# EAGLE design Test_board (EAGLE 9.6.2)
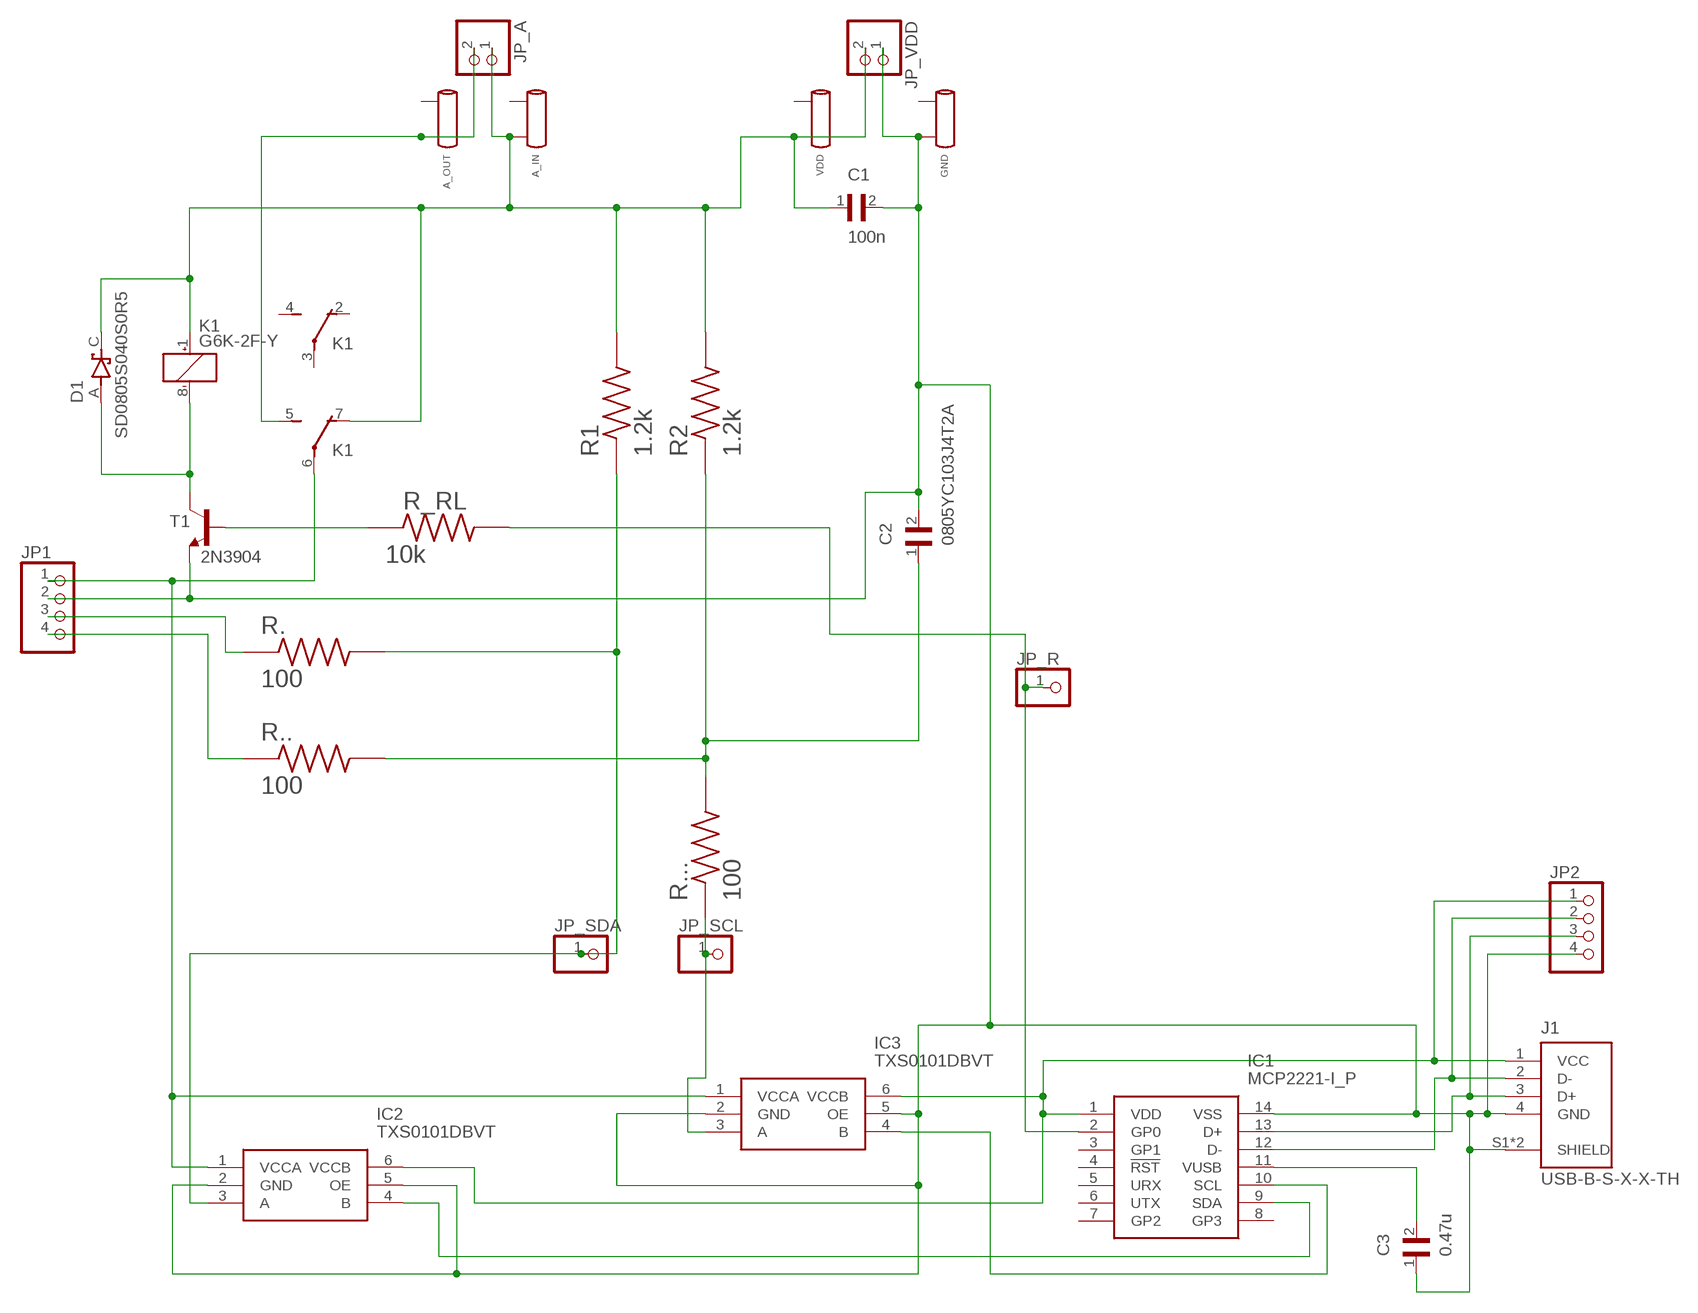
[diagram p0: schematic, sheet 1]

## Parts
A_IN  FY_TESTSOCKET  [FY_TESTSOCKET]
A_OUT  FY_TESTSOCKET  [FY_TESTSOCKET]
C1  100n  0805YC103J4T2A  [CAPC2012X94N]
C2  0805YC103J4T2A  [CAPC2012X94N]
C3  0.47u  0805YC103J4T2A  [CAPC2012X94N]
D1  SD0805S040S0R5  [DIOSC130X200X100-2N]
GND  FY_TESTSOCKET  [FY_TESTSOCKET]
IC1  MCP2221-I_P  [DIP781W56P254L1918H533Q14N]
IC2  TXS0101DBVT  [SOT95P280X145-6N]
IC3  TXS0101DBVT  [SOT95P280X145-6N]
J1  USB-B-S-X-X-TH  [SAMTEC_USB-B-S-X-X-TH]
JP1  PINHD-1X4  [1X04]
JP2  PINHD-1X4  [1X04]
JP_A  PINHD-1X2  [1X02]
JP_R  PINHD-1X1  [1X01]
JP_SCL  PINHD-1X1  [1X01]
JP_SDA  PINHD-1X1  [1X01]
JP_VDD  PINHD-1X2  [1X02]
K1  G6K-2F-Y  [G6K-2F-Y]
R1  1.2k  CR0805AJ/-000EAS  [RESC2012X60N]
R2  1.2k  CR0805AJ/-000EAS  [RESC2012X60N]
R.  100  CR0805AJ/-000EAS  [RESC2012X60N]
R..  100  CR0805AJ/-000EAS  [RESC2012X60N]
R...  100  CR0805AJ/-000EAS  [RESC2012X60N]
R_RL  10k  CR0805AJ/-000EAS  [RESC2012X60N]
T1  2N3904  [TO92]
VDD  FY_TESTSOCKET  [FY_TESTSOCKET]

## Nets
N$1: D1.A K1.8(1:-) T1.1(C)
N$2: C1.2 C2.2 C3.1 GND.P$2 IC1.14(VSS) IC2.2(GND) IC2.5(OE) IC3.2(GND) IC3.5(OE) J1.4(GND) J1.S1(SHIELD) J1.S2(SHIELD) JP1.2 JP2.4 JP_VDD.1 T1.3(E)
N$3: A_OUT.P$2 JP_A.2 K1.5(3:S)
N$4: C3.2 IC1.11(VUSB)
N$5: C2.1 R2.1 R...2 R....2
N$6: IC2.3(A) JP_SDA.1 R1.1 R..2
N$7: IC3.3(A) JP_SCL.1 R....1
N$8: JP1.3 R..1
N$9: JP1.4 R...1
N$10: IC2.1(VCCA) IC3.1(VCCA) JP1.1 K1.6(3:P)
N$11: IC1.9(SDA) IC2.4(B)
N$12: IC1.10(SCL) IC3.4(B)
N$13: IC1.1(VDD) IC2.6(VCCB) IC3.6(VCCB) J1.1(VCC) JP2.1
N$15: R_RL.1 T1.2(B)
N$16: A_IN.P$2 C1.1 D1.C(K) JP_A.1 JP_VDD.2 K1.1(1:+) K1.7(3:O) R1.2 R2.2 VDD.P$2
N$17: IC1.13(D+) J1.3(D+) JP2.3
N$18: IC1.12(D-) J1.2(D-) JP2.2
N$20: IC1.2(GP0) JP_R.1 R_RL.2
Unconnected: A_IN.P$1 A_OUT.P$1 GND.P$1 IC1.3(GP1) IC1.4(!RST) IC1.5(URX) IC1.6(UTX) IC1.7(GP2) IC1.8(GP3) K1.2(2:O) K1.3(2:P) K1.4(2:S) VDD.P$1

## Library data of the parts
A_IN A_OUT GND VDD = dut_kp300_manu_ch_multiple:FY_TESTSOCKET
C1-C3 = 0805YC103J4T2A:0805YC103J4T2A: Cap Ceramic 0.01uF 16V X7R 5% SMD 0805 125°C Paper T/R Check availability <https://pricing.snapeda.com/parts/0805YC103J4T2A/AVX/view-part?ref=eda>; AVAILABILITY: In Stock; CHECK_PRICES: https://www.snapeda.com/parts/0805YC103J4T2A/AVX/view-part/?ref=eda; DESCRIPTION: 10000 pF ±5% 16V Ceramic Capacitor X7R 0805 (2012 Metric); MF: AVX; MP: 0805YC103J4T2A; PACKAGE: 2012 AVX; PRICE: None; SNAPEDA_LINK: https://www.snapeda.com/parts/0805YC103J4T2A/AVX/view-part/?ref=snap
D1 = SD0805S040S0R5:SD0805S040S0R5: Diode Schottky 40V 500mA (DC) Surface Mount 0805 (2012 Metric) Check availability <https://pricing.snapeda.com/parts/SD0805S040S0R5/AVX/view-part?ref=eda>; AVAILABILITY: In Stock; CHECK_PRICES: https://www.snapeda.com/parts/SD0805S040S0R5/AVX/view-part/?ref=eda; DESCRIPTION: Diode Schottky 40 V 500mA (DC) Surface Mount 0805 (2012 Metric); MF: AVX; MP: SD0805S040S0R5; PACKAGE: 0805 AVX; PRICE: None; SNAPEDA_LINK: https://www.snapeda.com/parts/SD0805S040S0R5/AVX/view-part/?ref=snap
IC1 = MCP2221-I_P:MCP2221-I_P: USB 2.0 to I2C/UART Converter GPIO DIP14 Microchip MCP2221-I/P, USB Converter, USB 2.0 at 12MBps, 3 5.5 V, 14-Pin PDIP Source: Datasheet <https://datasheet.datasheetarchive.com/originals/distributors/DKDS-15/280084.pdf>; ARROW_PART_NUMBER: MCP2221-I/P; ARROW_PRICE-STOCK: https://www.arrow.com/en/products/mcp2221-ip/microchip-technology?region=nac; DESCRIPTION: USB 2.0 to I2C/UART Converter GPIO DIP14 Microchip MCP2221-I/P, USB Converter, USB 2.0 at 12MBps, 3 5.5 V, 14-Pin PDIP; HEIGHT: 5.334mm; MANUFACTURER_NAME: Microchip; MANUFACTURER_PART_NUMBER: MCP2221-I/P; MOUSER_PART_NUMBER: 579-MCP2221-I/P; MOUSER_PRICE-STOCK: https://www.mouser.co.uk/ProductDetail/Microchip-Technology/MCP2221-I-P?qs=wzzOUr4NhYr7J0lc1HgHIQ%3D%3D
IC2 IC3 = TXS0101DBVT:TXS0101DBVT: 1-Bit Bidirectional Voltage-Level Shifter for Open-Drain and Push-Pull Application Source: Datasheet <http://www.ti.com/lit/gpn/TXS0101>; DESCRIPTION: 1-Bit Bidirectional Voltage-Level Shifter for Open-Drain and Push-Pull Application; HEIGHT: 1.45mm; MANUFACTURER_NAME: Texas Instruments; MANUFACTURER_PART_NUMBER: TXS0101DBVT; MOUSER_PART_NUMBER: 595-TXS0101DBVT; MOUSER_PRICE-STOCK: https://www.mouser.co.uk/ProductDetail/Texas-Instruments/TXS0101DBVT?qs=dqESbKqT1jZcpvQ8SmOthw%3D%3D
J1 = USB-B-S-X-X-TH:USB-B-S-X-X-TH: USB-B (USB TYPE-B) USB 2.0 Receptacle Connector 4 Position Through Hole, Right Angle Check availability <https://pricing.snapeda.com/parts/USB-B-S-F-B-TH/Samtec/view-part?ref=eda>; AVAILABILITY: In Stock; CHECK_PRICES: https://www.snapeda.com/parts/USB-B-S-F-B-TH/Samtec+Inc./view-part/?ref=eda; DESCRIPTION: USB-B (USB TYPE-B) USB 2.0 Receptacle Connector 4 Position Through Hole, Right Angle; MF: Samtec; MP: USB-B-S-F-B-TH; PACKAGE: None; PRICE: None; SNAPEDA_LINK: https://www.snapeda.com/parts/USB-B-S-F-B-TH/Samtec+Inc./view-part/?ref=snap
JP1 JP2 = pinhead:PINHD-1X4: PIN HEADER
JP_A JP_VDD = pinhead:PINHD-1X2: PIN HEADER
JP_R JP_SCL JP_SDA = pinhead:PINHD-1X1: PIN HEADER
K1 = relay:G6K: Low Signal Relay oeiwcsnts1.omron.com/.. D20G6K0100.pdf; MF: OMRON COMPONENTS USA; MPN: G6K-2F-Y DC3; OC_FARNELL: 1690316; OC_NEWARK: 89C6451
R1 R2 R. R.. R... R_RL = CR0805AJ_-000EAS:CR0805AJ/-000EAS: Check availability <https://pricing.snapeda.com/parts/CR0805AJ/-000EAS/Bourns/view-part?ref=eda>; AVAILABILITY: In Stock; CHECK_PRICES: https://www.snapeda.com/parts/CR0805AJ/-000EAS/Bourns/view-part/?ref=eda; DESCRIPTION: Resistor, AS 0805 0R Jumper 125mW, AEC-Q, Anti-Sulfur | Bourns CR0805AJ/-000EAS; MF: Bourns; MP: CR0805AJ/-000EAS; PACKAGE: 0805 Bourns; PRICE: None; PURCHASE-URL: https://www.snapeda.com/api/url_track_click_mouser/?unipart_id=4001965&manufacturer=Bourns&part_name=CR0805AJ/-000EAS&search_term=None; SNAPEDA_LINK: https://www.snapeda.com/parts/CR0805AJ/-000EAS/Bourns/view-part/?ref=snap
T1 = transistor:2N3904: NPN TRANSISTOR

## Board
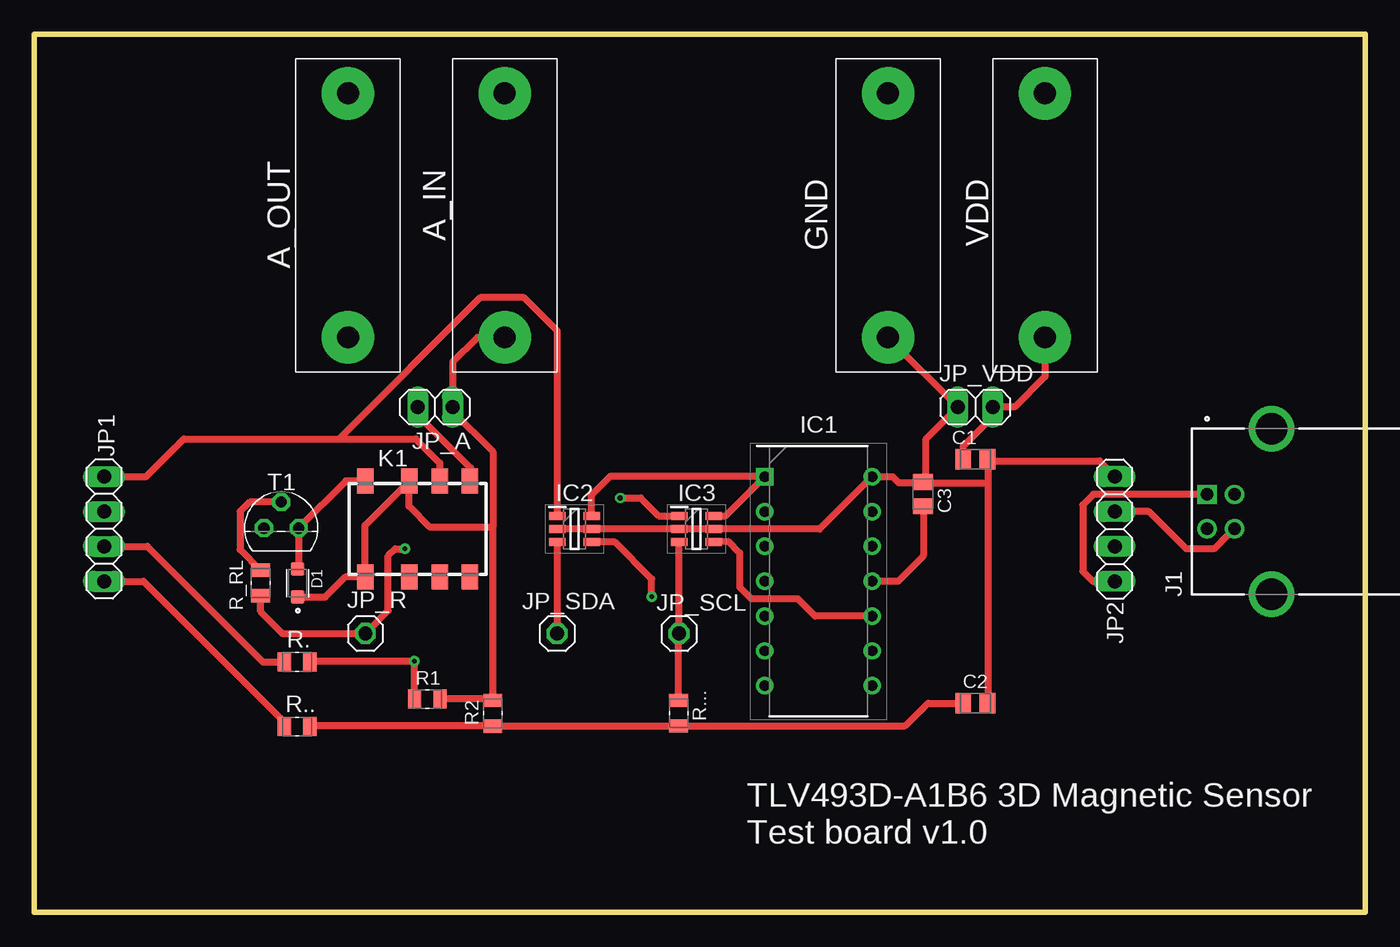
[diagram p1: board, top side]
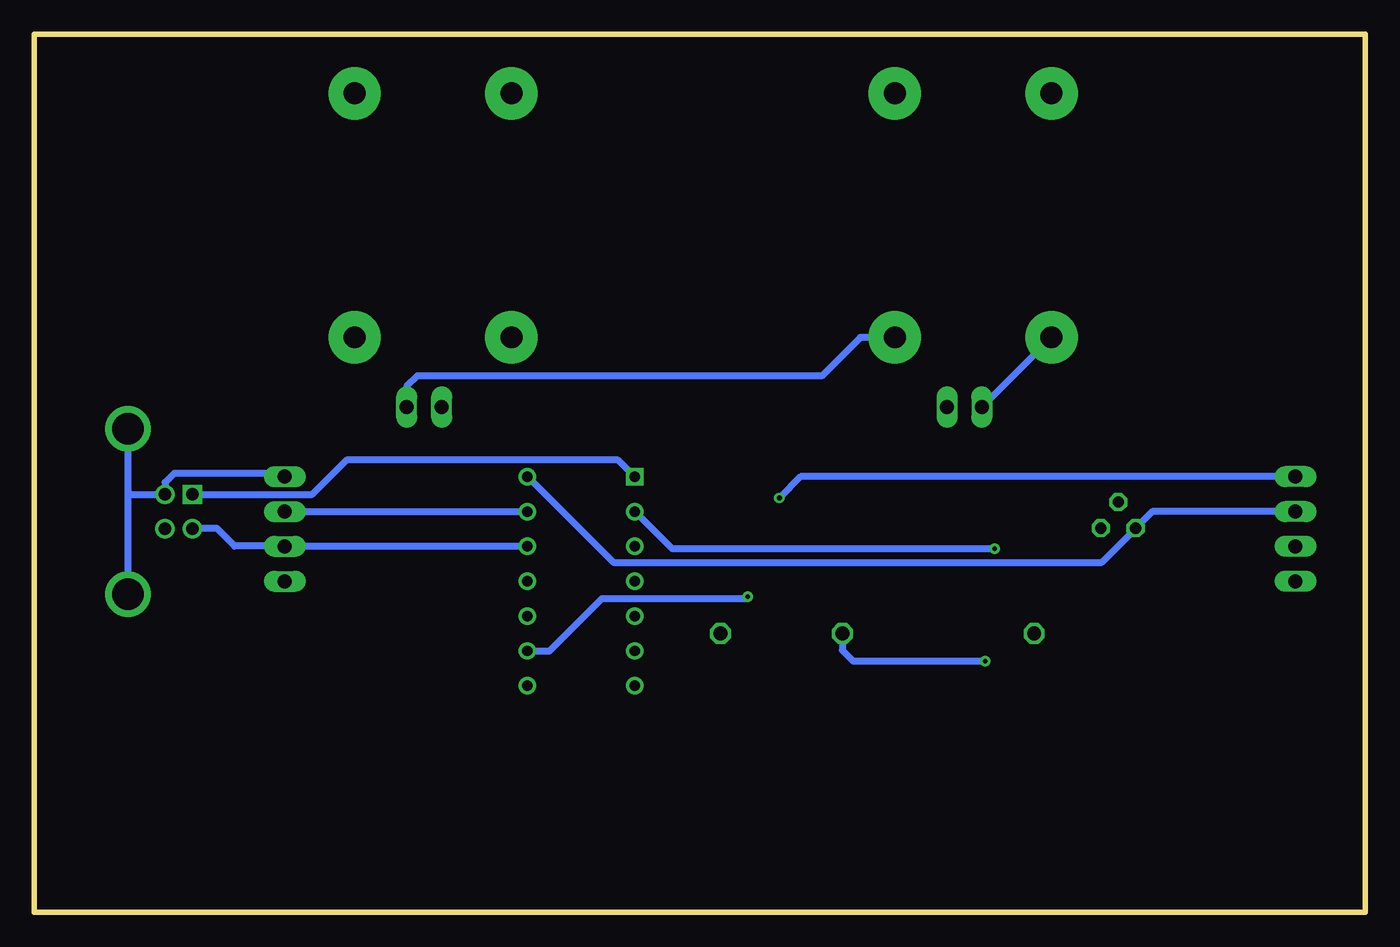
[diagram p2: board, bottom side, seen from below]

Size 97 x 64 mm. Coordinates in mm from the lower left corner, seen from the top.
Outline: 0,0 97,0 97,64 0,64 0,0
Copper layers (1*16): Top 0.035mm / dielectric 1.5mm / Bottom 0.035mm
Design rules "default *": minimum track width 20mil, minimum drill 0.35mm, track to track 6mil, track to pad 6mil, pad to pad 6mil, via to via 6mil, smd to smd 6mil, copper to edge 40mil, drill to drill 6mil, minimum pad ring 10mil, minimum via ring 8mil, stop-mask expansion 4mil, vias tented up to drill 0mil, thermal gap 10mil

### Footprints (pad centres in the part's own frame; a part is rotated, then mirrored left to right if it is on the bottom)
FY_TESTSOCKET = drill 1.6 pad 3.81: P$1 -7.62,0; P$2 10.16,0
CAPC2012X94N = smd 1.16 x 1.47: 1 -0.88,0; 2 0.88,0
DIOSC130X200X100-2N = smd 0.99 x 0.97: A 1.02,0; C -1.02,0
DIP781W56P254L1918H533Q14N = drill 0.758 pad 1.158 square: 1 -3.905,7.62 | drill 0.758 pad 1.158: 2 -3.905,5.08; 3 -3.905,2.54; 4 -3.905,0; 5 -3.905,-2.54; 6 -3.905,-5.08; 7 -3.905,-7.62; 8 3.905,-7.62; 9 3.905,-5.08; 10 3.905,-2.54; 11 3.905,0; 12 3.905,2.54; 13 3.905,5.08; 14 3.905,7.62
SOT95P280X145-6N = smd 1.2 x 0.6: 1 -1.25,0.95; 2 -1.25,0; 3 -1.25,-0.95; 4 1.25,-0.95; 5 1.25,0; 6 1.25,0.95
SAMTEC_USB-B-S-X-X-TH = drill 0.9 square: 1 1.25,4.7 | drill 0.9: 2 -1.25,4.7; 3 -1.25,2.7; 4 1.25,2.7 | drill 2.3: S1 -6.02,0; S2 6.02,0
1X04 = drill 1.016 long: 1 -3.81,0; 2 -1.27,0; 3 1.27,0; 4 3.81,0
1X02 = drill 1.016 long: 1 -1.27,0; 2 1.27,0
1X01 = drill 1.016 octagon: 1 0,0
G6K-2F-Y = smd 1.2 x 1.8: 1 -3.8,-3.5; 2 -0.6,-3.5; 3 1.6,-3.5; 4 3.8,-3.5; 5 3.8,3.5; 6 1.6,3.5; 7 -0.6,3.5; 8 -3.8,3.5
RESC2012X60N = smd 0.97 x 1.38: 1 -0.93,0; 2 0.93,0
TO92 = drill 0.813 octagon: 1 1.27,0; 2 0,1.905; 3 -1.27,0

### Placement (x,y rotation side)
A_IN  34.29,52.07 270 top
A_OUT  22.86,52.07 270 top
C1  68.58,33.02 0 top
C2  68.58,15.24 0 top
C3  64.77,30.48 270 top
D1  19.2,24 90 top
GND  62.23,52.07 270 top
IC1  57.15,24.13 0 top
IC2  39.37,27.94 0 top
IC3  48.26,27.94 0 top
J1  90.17,29.21 90 top
JP1  5.08,27.94 270 top
JP2  78.74,27.94 90 top
JP_A  29.21,36.83 180 top
JP_R  24.13,20.32 0 top
JP_SCL  46.99,20.32 0 top
JP_SDA  38.1,20.32 0 top
JP_VDD  68.58,36.83 0 top
K1  27.94,27.94 0 top
R1  28.65,15.54 0 top
R2  33.42,14.51 90 top
R.  19.15,18.25 0 top
R..  19.15,13.54 0 top
R...  46.96,14.52 270 top
R_RL  16.5,24 270 top
T1  18,28 0 top
VDD  73.66,52.07 270 top

### Tracks (layer width: path | path; a pad name or v marks a point on that pad's centre or on a via)
N$1
  Top 0.508: 24,31 K1.8 22.71,31.44 T1.1 19.27,25.09 D1.A
N$2
  Top 0.508: 69.5,32.9 69.5,33 C1.2 | 69.5,32.9 69.5,31.3 | 69.5,31.3 69.5,15.5 C2.2 | 69.5,32.9 77.64,32.9 JP2.4 | IC2.2 IC2.5 IC3.2 IC3.5 57.24,27.94 IC1.14 62.55,31.75 63.01,31.3 64.71,31.3 C3.1 | C3.1 65,31.5 65,34.5 67,36.5 JP_VDD.1 GND.P$2 | 69.5,31.3 64.81,31.3 C3.1
  Bottom 0.508: JP2.4 79,32 86.8,32 87.47,31.33 J1.4 90.03,30.46 90.17,30.6 | IC1.14 54.8,25.5 19.2,25.5 16.73,27.97 T1.3 15.52,29.21 JP1.2 | J1.S1 90.17,30.6 | 90.17,30.6 J1.S2
N$3
  Top 0.508: K1.5 31.8,31.5 31.8,32.4 27.94,36.26 JP_A.2
  Bottom 0.508: A_OUT.P$2 JP_A.2
N$4
  Top 0.508: C3.2 64.8,29.57 64.8,25.98 62.95,24.13 IC1.11
N$5
  Top 0.508: 20.1,13.3 R...2 20.12,13.58 R2.1 R....2 63.49,13.59 65.14,15.24 C2.1
N$6  (via drill 0.35)
  Top 0.508: IC2.3 38.1,26.97 JP_SDA.1 | R..2 20.13,18.3 v27.7,18.3 27.7,15.56 R1.1
  Bottom 0.508: JP_SDA.1 38.1,19.1 37.3,18.3 v27.7,18.3
N$7
  Top 0.508: 47,20.5 IC3.3 | 47,20.5 JP_SCL.1 47,20 | R....1 46.96,20.46 47,20.5
N$8
  Top 0.508: 18.1,18.7 R..1 16.65,18.25 8.23,26.67 JP1.3
N$9
  Top 0.508: 18.1,13.8 R...1 18.18,13.5 18.18,13.92 7.97,24.13 JP1.4
N$10  (via drill 0.35)
  Top 0.508: IC2.1 38.1,28.91 38.1,42.4 35.7,44.8 32.5,44.8 22.2,34.5 | 22.2,34.5 27.8,34.5 29.54,32.76 K1.6 | JP1.1 8.15,31.75 10.9,34.5 22.2,34.5 | v42.7,30.2 44.2,30.2 45.51,28.89 IC3.1
  Bottom 0.508: v42.7,30.2 41.15,31.75 JP1.1
N$11  (via drill 0.35)
  Top 0.508: v45,23 45,24.3 42.31,26.99 IC2.4
  Bottom 0.508: v45,23 45.14,22.86 55.64,22.86 59.45,19.05 IC1.9
N$12
  Top 0.508: IC3.4 50.59,27.01 51.4,26.2 51.4,23.7 52.24,22.86 55.63,22.86 56.91,21.59 IC1.10
N$13
  Top 0.508: IC2.6 40.62,30.42 42,31.8 53.2,31.8 IC1.1 50.38,28.89 IC3.6 | 85,30.5 J1.1 77.18,30.47 76.41,29.69 76.41,24.86 77.14,24.13 JP2.1
  Bottom 0.508: J1.1 76.74,30.46 74.2,33 54.49,33 IC1.1
N$15
  Top 0.508: T1.2 15.7,29.91 15,29.2 15,26.43 R_RL.1
N$16
  Top 0.508: 19.2,23 D1.C 21.2,22.98 22.66,24.44 K1.1 24.1,24.48 24.1,28.2 K1.7 | 27.15,31.15 27,31 K1.7 | 30.5,36.5 33.42,33.58 33.42,28.1 | 30.5,36.5 JP_A.1 | R1.2 33.32,15.54 R2.2 33.42,28.1 | K1.7 27.3,31.4 27.3,29.6 28.8,28.1 33.42,28.1 | A_IN.P$2 32.29,41.91 30.5,40.12 30.5,36.5 | VDD.P$2 73.66,39.04 71.45,36.83 JP_VDD.2 69.85,36.13 67.7,33.98 C1.1
  Bottom 0.508: A_IN.P$2 36.79,41.91 39.6,39.1 69.1,39.1 69.85,38.35 JP_VDD.2
N$17
  Top 0.508: J1.3 87,27.5 86,26.5 83.95,26.5 81.24,29.21 JP2.3
  Bottom 0.508: JP2.3 61.06,29.2 IC1.13
N$18
  Bottom 0.508: IC1.12 61.09,26.7 78.72,26.7 JP2.2 78.76,26.7 82.41,26.7 83.67,27.96 J1.2
N$20  (via drill 0.35)
  Top 0.508: R_RL.2 16.5,21.9 18.1,20.3 24.11,20.3 JP_R.1 25.8,22 25.8,26 26.3,26.5 v27,26.5
  Bottom 0.508: v27,26.5 50.5,26.5 53,29 IC1.2

### Text on the board
tNames: TLV493D-A1B6 3D Magnetic Sensor / Test board v1.0